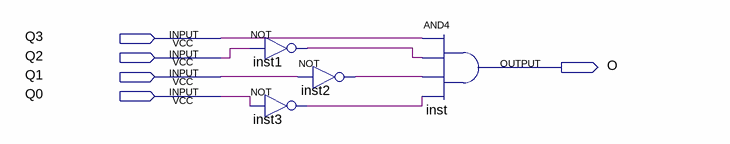
[diagram p0: schematic sheet]
// Quartus schematic Output.bdf as structural Verilog: 4 symbols, 5 pins
module Output (
  input  Q3,
  input  Q2,
  input  Q1,
  input  Q0,
  output O
);

  wire inst1_out, inst2_out, inst3_out;

  not inst1 (inst1_out, Q2);
  not inst3 (inst3_out, Q0);
  not inst2 (inst2_out, Q1);
  and inst (O, Q3, inst1_out, inst2_out, inst3_out);
endmodule
